# EasyEDA schematic SCH_datacon_2024-01-26.json

## Sheets
1 ESP32-C3: TITLE: Sheet_1; REV: 1.0; Date: 2023-10-29; Sheet: 1/1; Drawn By: FrankIin; Company: Your Company
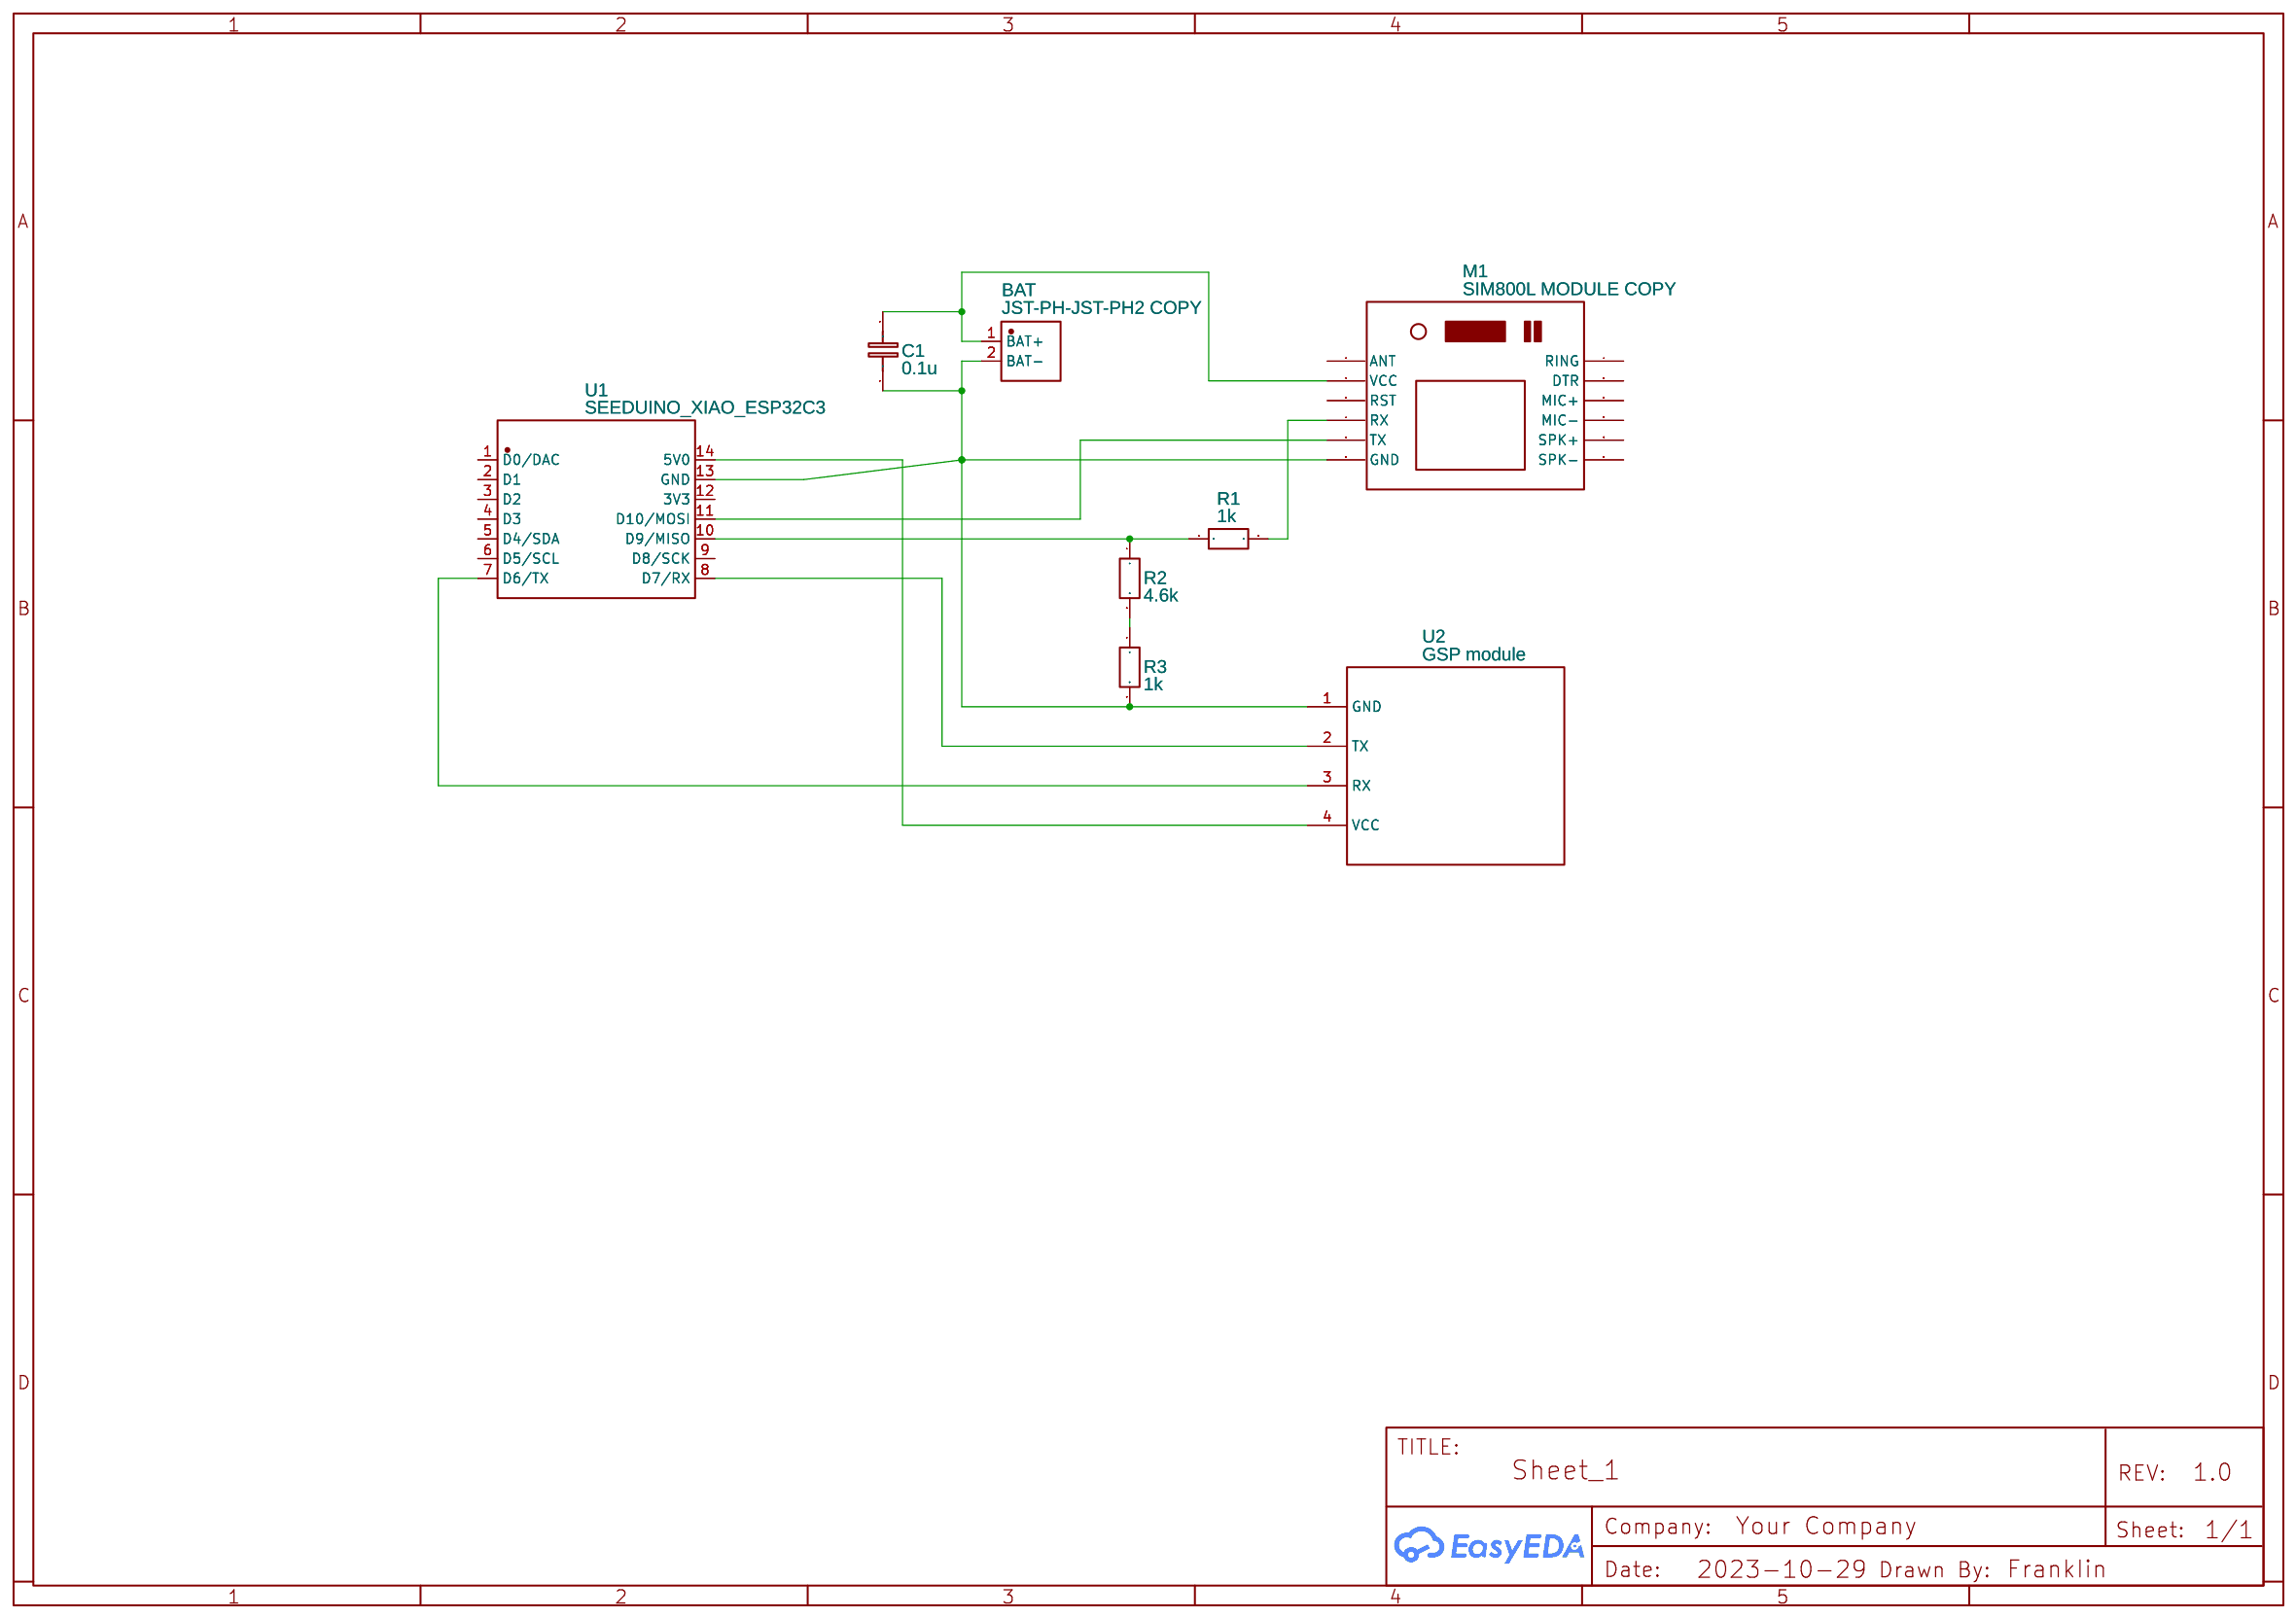
[diagram p0: ESP32-C3]
2 Current design copy: Date: 2023-12-14
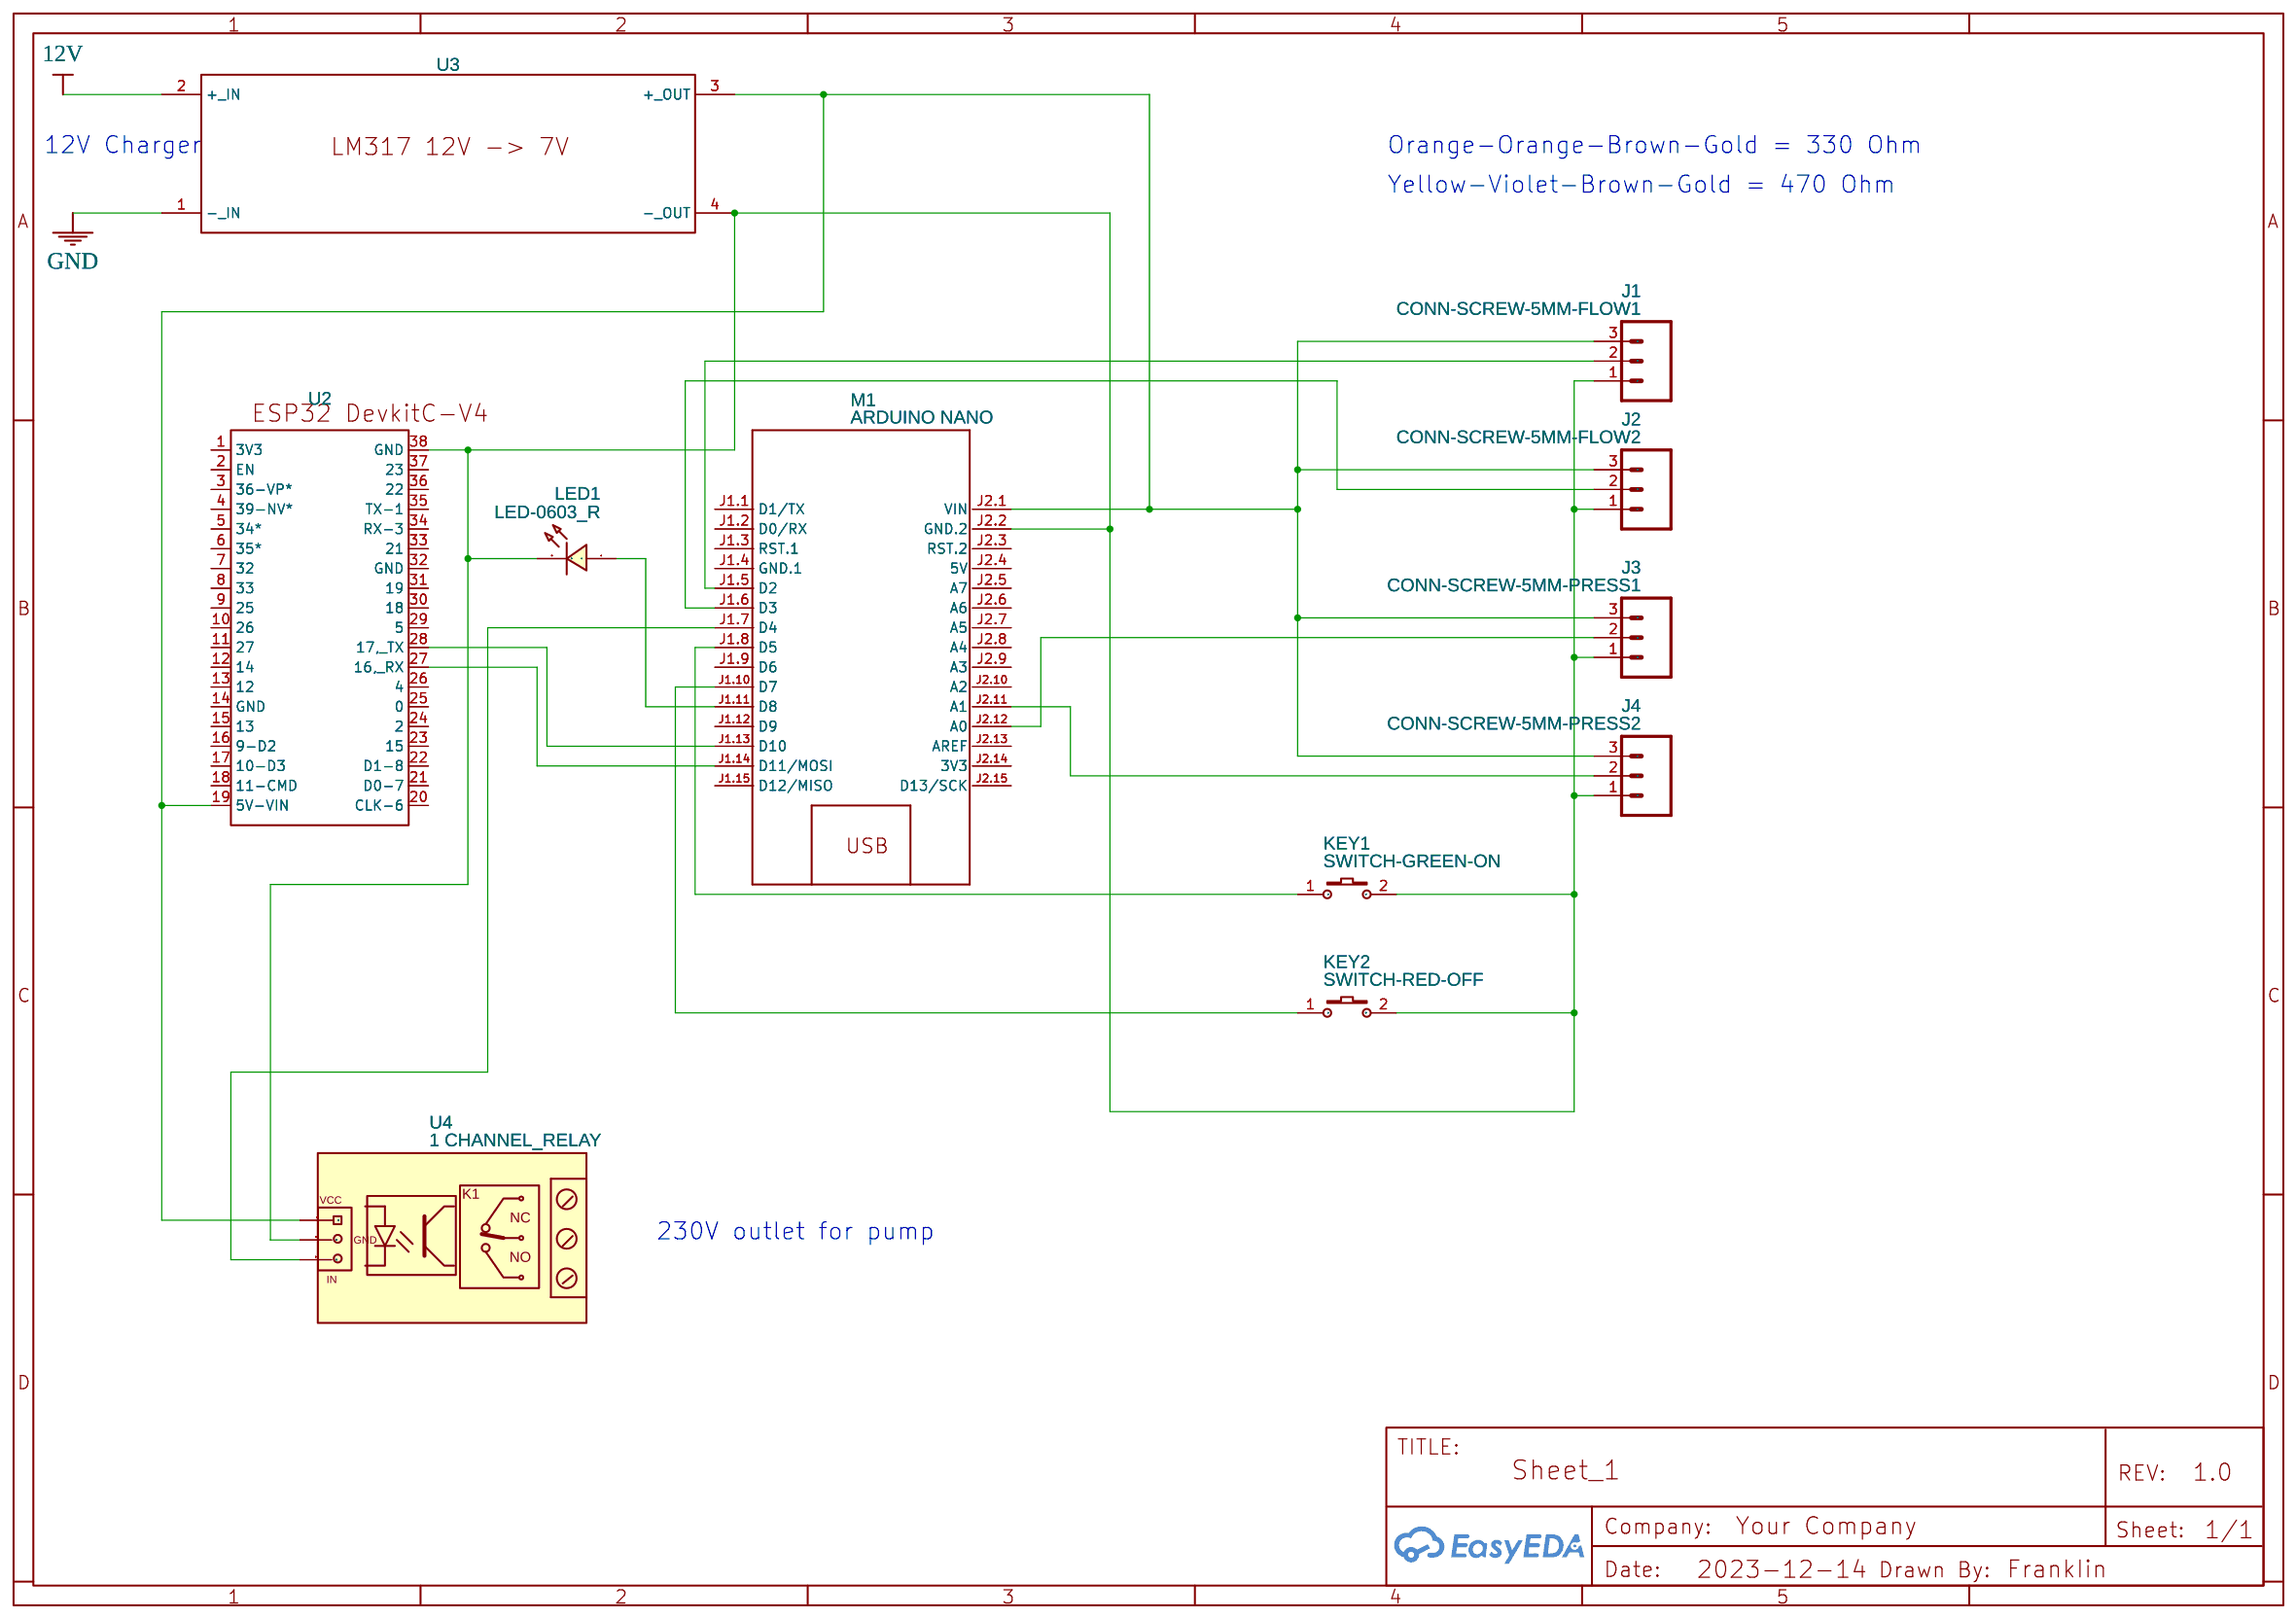
[diagram p1: Current design copy]
3 Our design 1.2: TITLE: PCB Vitens Project; Date: 2023-12-14; Company: Vitens Project S1/23-24
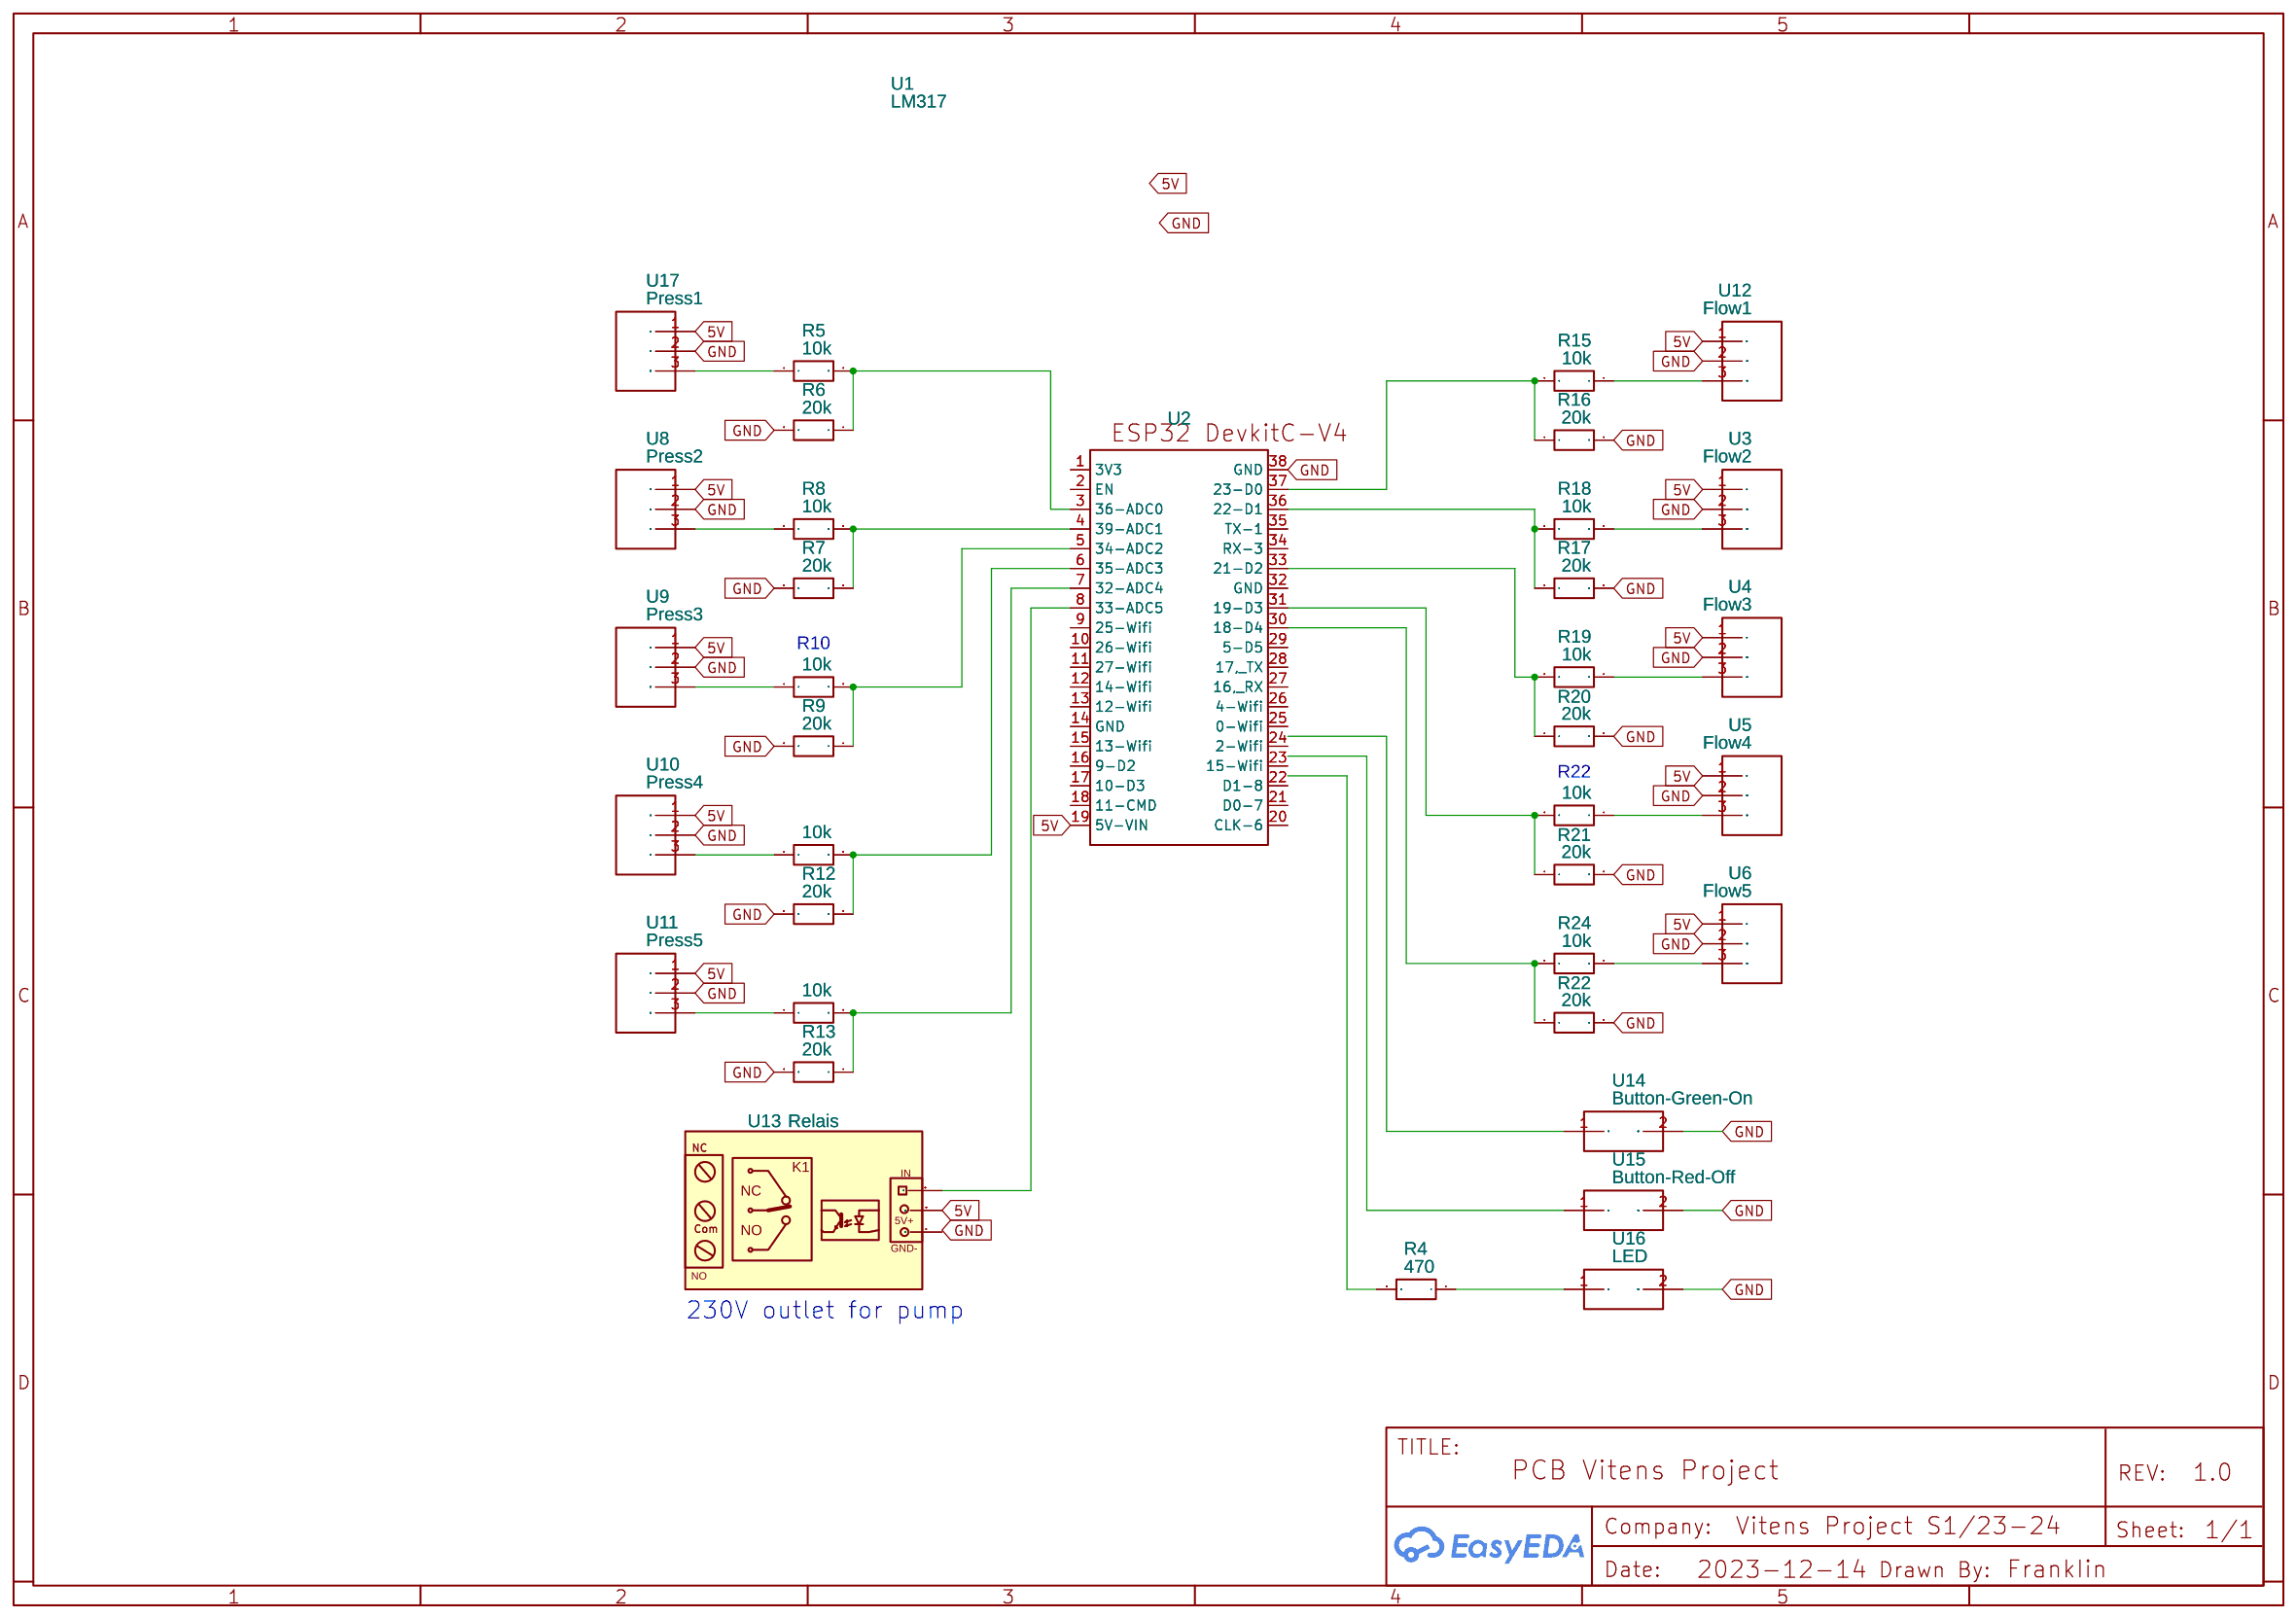
[diagram p2: Our design 1.2]

## Parts
sheet Current design copy
J1  CONN-SCREW-5MM-FLOW1  [SCREWTERMINAL-5MM-3]
J2  CONN-SCREW-5MM-FLOW2  [SCREWTERMINAL-5MM-3]
J3  CONN-SCREW-5MM-PRESS1  [SCREWTERMINAL-5MM-3]
J4  CONN-SCREW-5MM-PRESS2  [SCREWTERMINAL-5MM-3]
KEY1  SWITCH-GREEN-ON  [KEY-SMD_2P-L6.2-W3.6-LS8.0]
KEY2  SWITCH-RED-OFF  [KEY-SMD_2P-L6.2-W3.6-LS8.0]
LED1  LED-0603_R  [LED0603_RED]
M1#2  ARDUINO NANO  [ARDUINO-NANO-3.0]
U2#2  ESP32-AZ-DELIVERY-DEVKITC-V4 COPY  [ESP32-AZ-DELIVERY-38PIN-DIP]
U3  LM2596 DC-DC Step-Down Buck Converter Power Module  [DC-DC STEP DOWN BUCK CONVERTER MODULE LM2596]
U4  1 CHANNEL_RELAY  [RELAY MODULE 1 RELAYS]
sheet ESP32-C3
BAT  JST-PH-JST-PH2 COPY  [JST-PH-JST-PH2]
C1  0.1u  [C0603]
M1  SIM800L MODULE COPY  [SIM800L]
R1  1k  [R0603]
R2  4.6k  [R0603]
R3  1k  [R0603]
U2  GSP module  [GY-GPS6MV2]
sheet Our design 1.2
R4  470  [R0603]
R5  10k  [R0603]
R6  20k  [R0603]
R7  20k  [R0603]
R8  10k  [R0603]
R9  20k  [R0603]
R10  10k  [R0603]
R11  10k  [R0603]
R12  20k  [R0603]
R13  20k  [R0603]
R14  10k  [R0603]
R15  10k  [R0603]
R16  20k  [R0603]
R17  20k  [R0603]
R18  10k  [R0603]
R19  10k  [R0603]
R20  20k  [R0603]
R21  20k  [R0603]
R22  20k  [R0603]
R23  10k  [R0603]
R24  10k  [R0603]
U1  LM317  [LM317]
U2#3  ESP32-AZ-DELIVERY-DEVKITC-V4 COPY  [ESP32-DEVKITC-V4]
U3#2  Flow2  [SENSOR]
U4#2  Flow3  [SENSOR]
U5  Flow4  [SENSOR]
U6  Flow5  [SENSOR]
U8  Press2  [SENSOR]
U9  Press3  [SENSOR]
U10  Press4  [SENSOR]
U11  Press5  [SENSOR]
U12  Flow1  [SENSOR]
U13  Relais  [RELAIS]
U14  Button-Green-On  [BUTTON]
U15  Button-Red-Off  [BUTTON]
U16  LED  [BUTTON]
U17  Press1  [SENSOR]

## Library data of the parts
J1-J4 = CONN_03-SCREW-5MM: Contributor: Ali Farooq
KEY1 KEY2 = K2-3.6×6.1_SMD: Supplier Part: C118141; Supplier: LCSC; Manufacturer Part: K2-1107ST-A4SW-06; Contributor: LCEDA_Lib; 制造商: 韩国韩荣
LED1 = LED-0603_R: Manufacturer: EVERLIGHT(台湾亿光); Manufacturer Part: 19-217/R6C-AL1M2VY/3T; Supplier Part: C72044; Supplier: LCSC; Contributor: LCEDA_01
M1#2 = ARDUINO-NANO-3.0 COPY: Contributor: Bb3 Bb3
U2#2 = ESP32-AZ-DELIVERY-DEVKITC-V4 COPY: Manufacturer: AZ-Delivery; Supplier: AZ-Delivery; Contributor: Das Teile
U3 = LM2596 DC-DC Step-Down Buck Converter Power Module: Supplier: Amazon.com; link: https://www.amazon.com/Converter-3-0-40V-1-5-35V-Efficiency-Regulator/dp/B07R4327RV/ref=sr_1_1_sspa?keywords=lm2596+dc-dc&qid=1562900651&s=gateway&sr=8-1-spons&psc=1; Contributor: Ricardo Ruiz
U4 = 1 CHANNEL_RELAY: Manufacturer Part: 1-Channel 5V Relay Module w/ Opto-isolator; Supplier Part: SKU: 223429; link: http://www.volumerate.com/product/1-channel-5v-relay-module-w-opto-isolator-red-blue-223429; Contributor: Foras
BAT = JST-PH-JST-PH2 COPY: Contributor: julian.boet
C1 = C_0603_EU: Contributor: LCEDA_Lib
M1 = SIM800L MODULE COPY: Contributor: barmanvssp
R1-R24 = R_0603_EU: Contributor: LCEDA_Lib
U2 = GSP module: Contributor: emilijaz
U1 = LM317: Contributor: frankiin
U2#3 = ESP32-AZ-DELIVERY-DEVKITC-V4 COPY: Manufacturer: AZ-Delivery; Supplier: AZ-Delivery; Contributor: Das Teile; Package Display: No
U3#2 U4#2 U5 U6 U8-U12 U17 = Sensor: Supplier: Amazon; Contributor: frankiin
U13 = Relais: Manufacturer Part: JQC-3FF-S-Z; Supplier Part: SKU: 223429; Supplier: Amazon; link: http://www.volumerate.com/product/1-channel-5v-relay-module-w-opto-isolator-red-blue-223429; Contributor: FrankIin; Manufacturer: Tongling
U14-U16 = Button: Supplier: Amazon; Contributor: FrankIin

## Nets
5V: U2#3.19(5V-VIN) U3#2.1(5V) U4#2.1(5V) U5.1(5V) U6.1(5V) U8.1(5V) U9.1(5V) U10.1(5V) U11.1(5V) U12.1(5V) U13.13(VCC) U17.1(5V)
12V: U3.2(+ IN)
GND: R6.2 R7.2 R9.2 R12.2 R13.2 R16.2 R17.2 R20.2 R21.2 R22.2 U2#3.38(GND) U3.1(- IN) U3#2.2(GND) U4#2.2(GND) U5.2(GND) U6.2(GND) U8.2(GND) U9.2(GND) U10.2(GND) U11.2(GND) U12.2(GND) U14.2(GND) U15.2(GND) U16.2(GND) U17.2(GND)
Net-(BAT-1): BAT.1(BAT+) C1.1 M1.2(VCC)
Net-(BAT-2): BAT.2(BAT-) C1.2 M1.6(GND) R3.2 U1.13(GND) U2.1(GND)
Net-(J1-1): J1.1 J2.1 J3.1 J4.1 KEY1.2 KEY2.2 LED1.2 M1#2.J2.2(GND.2) U2#2.38(GND) U3.4(- OUT) U4.2
Net-(J1-2): J1.2 M1#2.J1.5(D2)
Net-(J1-3): J1.3 J2.3 J3.3 J4.3 M1#2.J2.1(VIN) U2#2.19(5V-VIN) U3.3(+ OUT) U4.1
Net-(J2-2): J2.2 M1#2.J1.6(D3)
Net-(J3-2): J3.2 M1#2.J2.12(A0)
Net-(J4-2): J4.2 M1#2.J2.11(A1)
Net-(KEY1-1): KEY1.1 M1#2.J1.8(D5)
Net-(KEY2-1): KEY2.1 M1#2.J1.10(D7)
Net-(LED1-1): LED1.1 M1#2.J1.11(D8)
Net-(M1#2-J1.7): M1#2.J1.7(D4) U4.3
Net-(M1#2-J1.13): M1#2.J1.13(D10) U2#2.28(17, TX)
Net-(M1#2-J1.14): M1#2.J1.14(D11/MOSI) U2#2.27(16, RX)
Net-(M1-4): M1.4(RX) R1.2
Net-(M1-5): M1.5(TX) U1.11(D10/MOSI)
Net-(R1-1): R1.1 R2.1 U1.10(D9/MISO)
Net-(R2-2): R2.2 R3.1
Net-(R4-1): R4.1 U16.1(S)
Net-(R5-1): R5.1 U17.3(DATA)
Net-(R5-2): R5.2 R6.1 U2#3.3(36-ADC0)
Net-(R7-1): R7.1 R8.2 U2#3.4(39-ADC1)
Net-(R8-1): R8.1 U8.3(DATA)
Net-(R9-1): R9.1 R11.2 U2#3.5(34-ADC2)
Net-(R10-1): R10.1 U10.3(DATA)
Net-(R10-2): R10.2 R12.1 U2#3.6(35-ADC3)
Net-(R11-1): R11.1 U9.3(DATA)
Net-(R13-1): R13.1 R14.2 U2#3.7(32-ADC4)
Net-(R14-1): R14.1 U11.3(DATA)
Net-(R15-1): R15.1 U12.3(DATA)
Net-(R15-2): R15.2 R16.1 U2#3.37(23-D0)
Net-(R17-1): R17.1 R18.2 U2#3.36(22-D1)
Net-(R18-1): R18.1 U3#2.3(DATA)
Net-(R19-1): R19.1 U4#2.3(DATA)
Net-(R19-2): R19.2 R20.1 U2#3.33(21-D2)
Net-(R21-1): R21.1 R23.2 U2#3.31(19-D3)
Net-(R22-1): R22.1 R24.2 U2#3.30(18-D4)
Net-(R23-1): R23.1 U5.3(DATA)
Net-(R24-1): R24.1 U6.3(DATA)
Net-(U1-7): U1.7(D6/TX) U2.3(RX)
Net-(U1-8): U1.8(D7/RX) U2.2(TX)
Net-(U1-14): U1.14(5V0) U2.4(VCC)
Net-(U2#3-8): U2#3.8(33-ADC5) U13.15(In)

Not connected (* = marked no-connect by the designer): M1 1(ANT) 3(RST) 7(RING) 8(DTR) 9(MIC+) 10(MIC-) 11(SPK+) 12(SPK-); M1#2 J1.1(D1/TX) J1.2(D0/RX) J1.3(RST.1) J1.4(GND.1) J1.9(D6) J1.12(D9) J1.15(D12/MISO) J2.3(RST.2) J2.4(5V) J2.5(A7) J2.6(A6) J2.7(A5) J2.8(A4) J2.9(A3) J2.10(A2) J2.13(AREF) J2.14(3V3) J2.15(D13/SCK); R4 2; U1 1(D0/DAC) 2(D1) 3(D2) 4(D3) 5(D4/SDA) 6(D5/SCL) 9(D8/SCK) 12(3V3); U2#2 1(3V3) 2(EN) 3(36-VP*) 4(39-NV*) 5(34*) 6(35*) 7(32) 8(33) 9(25) 10(26) 11(27) 12(14) 13(12) 14(GND) 15(13) 16(9-D2) 17(10-D3) 18(11-CMD) 20(CLK-6) 21(D0-7) 22(D1-8) 23(15) 24(2) 25(0) 26(4) 29(5) 30(18) 31(19) 32(GND) 33(21) 34(RX-3) 35(TX-1) 36(22) 37(23); U2#3 1(3V3) 2(EN) 9(25-Wifi) 10(26-Wifi) 11(27-Wifi) 12(14-Wifi) 13(12-Wifi) 14(GND) 15(13-Wifi) 16(9-D2) 17(10-D3) 18(11-CMD) 20(CLK-6) 21(D0-7) 22(D1-8) 23(15-Wifi) 24(2-Wifi) 25(0-Wifi) 26(4-Wifi) 27(16, RX) 28(17, TX) 29(5-D5) 32(GND) 34(RX-3) 35(TX-1); U13 14(GND); U14 1(S); U15 1(S)

## Notes on the sheets
sheet 2
- 12V Charger
- Orange-Orange-Brown-Gold = 330 Ohm
- Yellow-Violet-Brown-Gold = 470 Ohm
- 230V outlet for pump
sheet 3
- R10
- R22
- 230V outlet for pump
